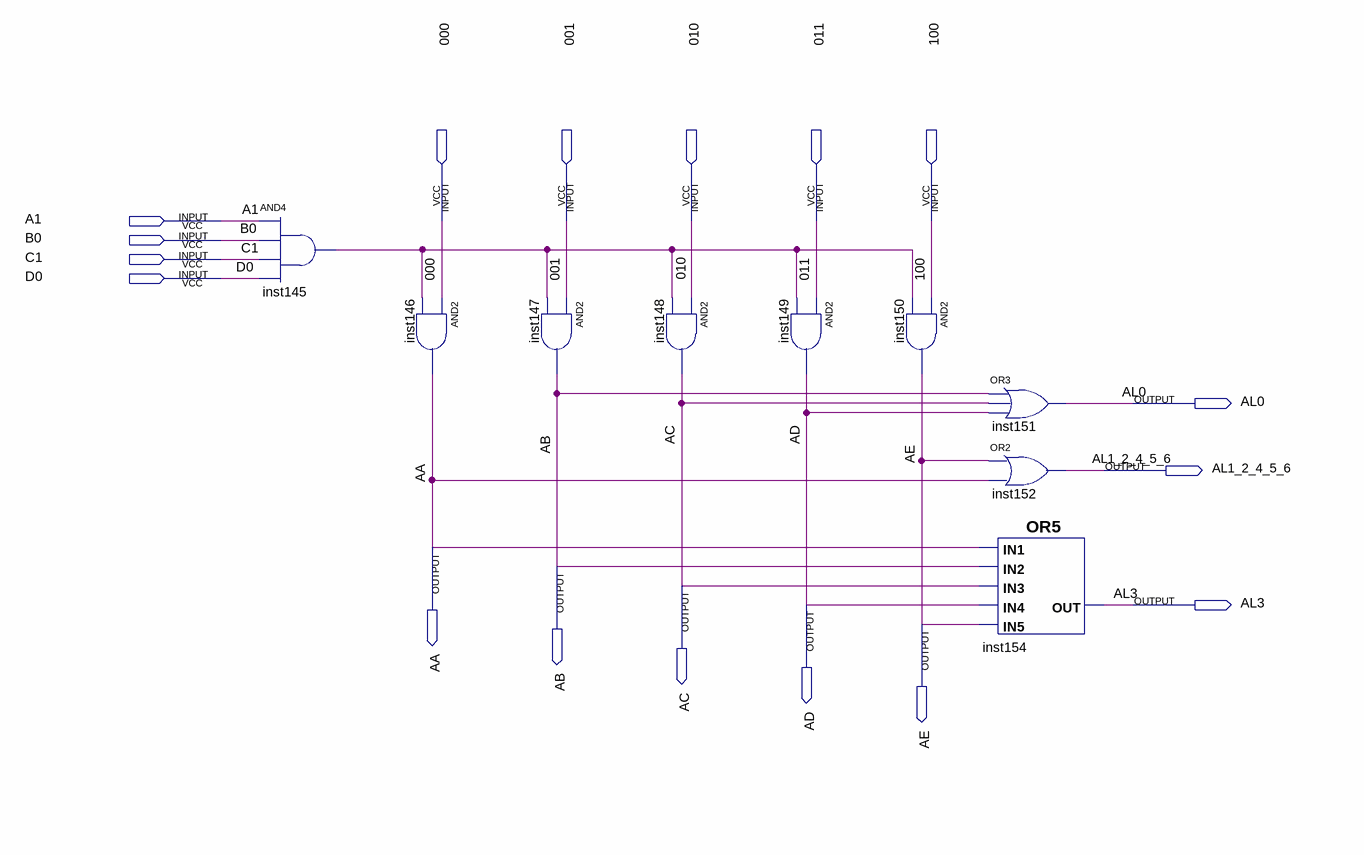
[diagram p0: schematic sheet]
// Quartus schematic caracA.bdf as structural Verilog: 9 symbols, 17 pins
module caracA (
  input  A1,
  input  \000 ,
  input  \001 ,
  input  \010 ,
  input  \011 ,
  input  \100 ,
  input  B0,
  input  C1,
  input  D0,
  output AL0,
  output AL1_2_4_5_6,
  output AA,
  output AB,
  output AC,
  output AD,
  output AL3,
  output AE
);

  wire inst145_out;

  and inst145 (inst145_out, A1, B0, C1, D0);
  and inst146 (AA, \000 , inst145_out);
  and inst147 (AB, \001 , inst145_out);
  and inst148 (AC, \010 , inst145_out);
  and inst149 (AD, \011 , inst145_out);
  and inst150 (AE, \100 , inst145_out);
  or inst154 (AL3, AA, AB, AC, AD, AE);
  or inst151 (AL0, AB, AC, AD);
  or inst152 (AL1_2_4_5_6, AE, AA);
endmodule
